# Altium schematic sheet ESP32_Dongle.SchDoc
size 599 x 400 mm; SheetNumber: 1; SheetTotal: 1
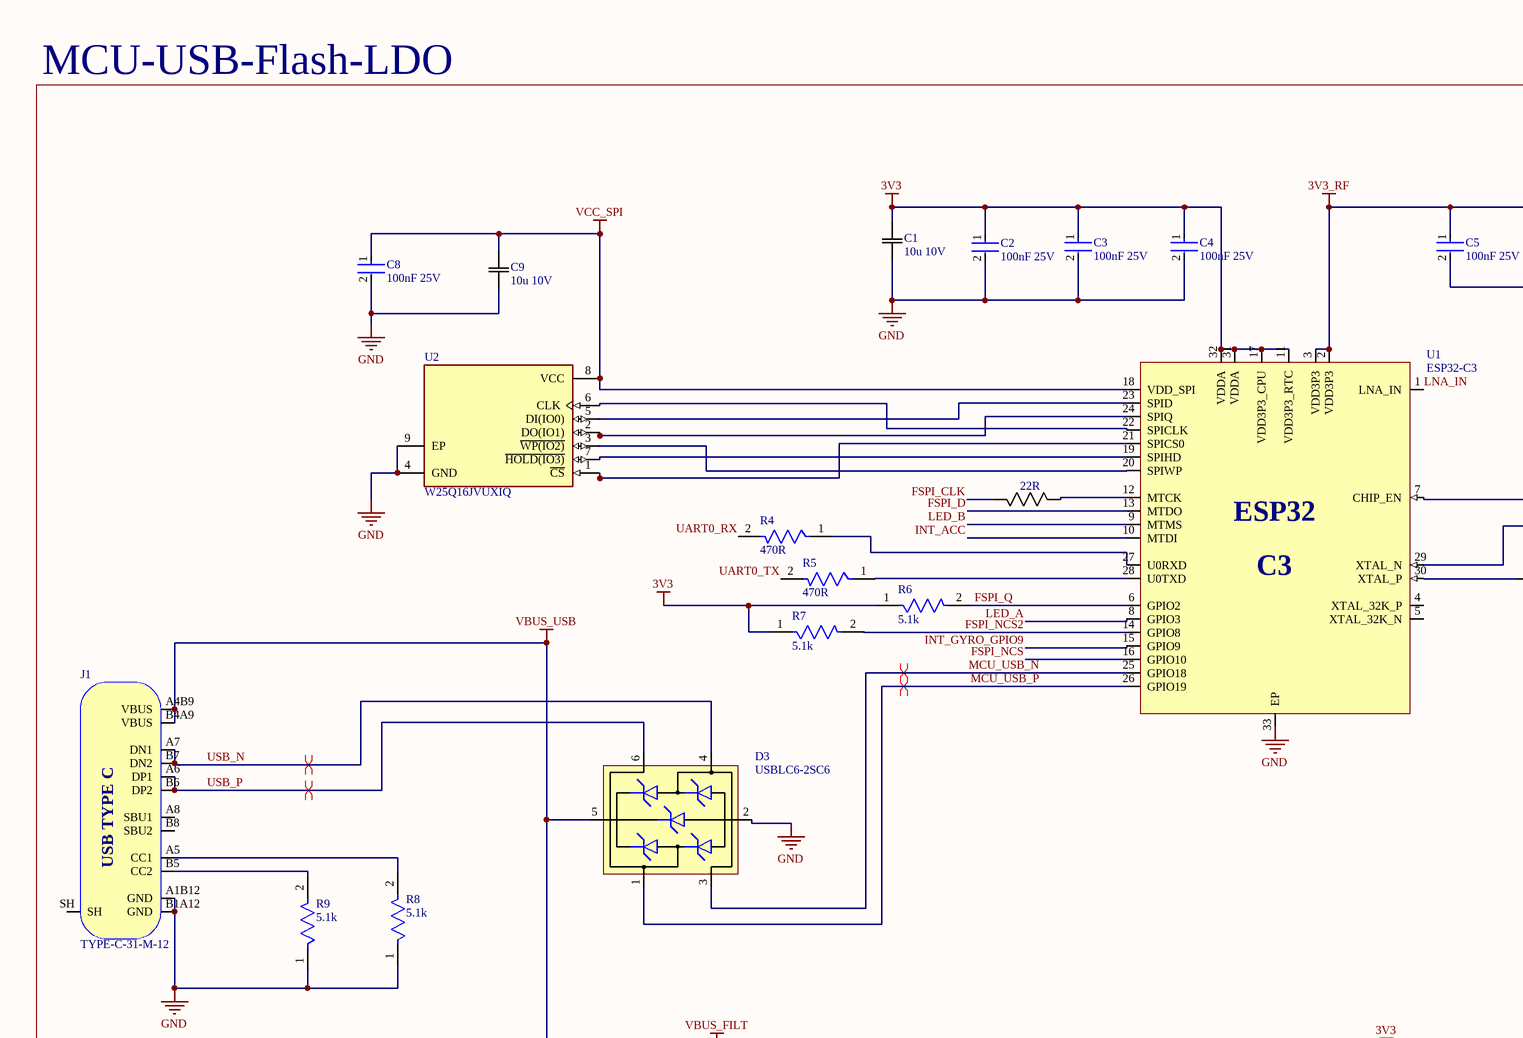
[diagram p0: ESP32_Dongle.SchDoc, top left]
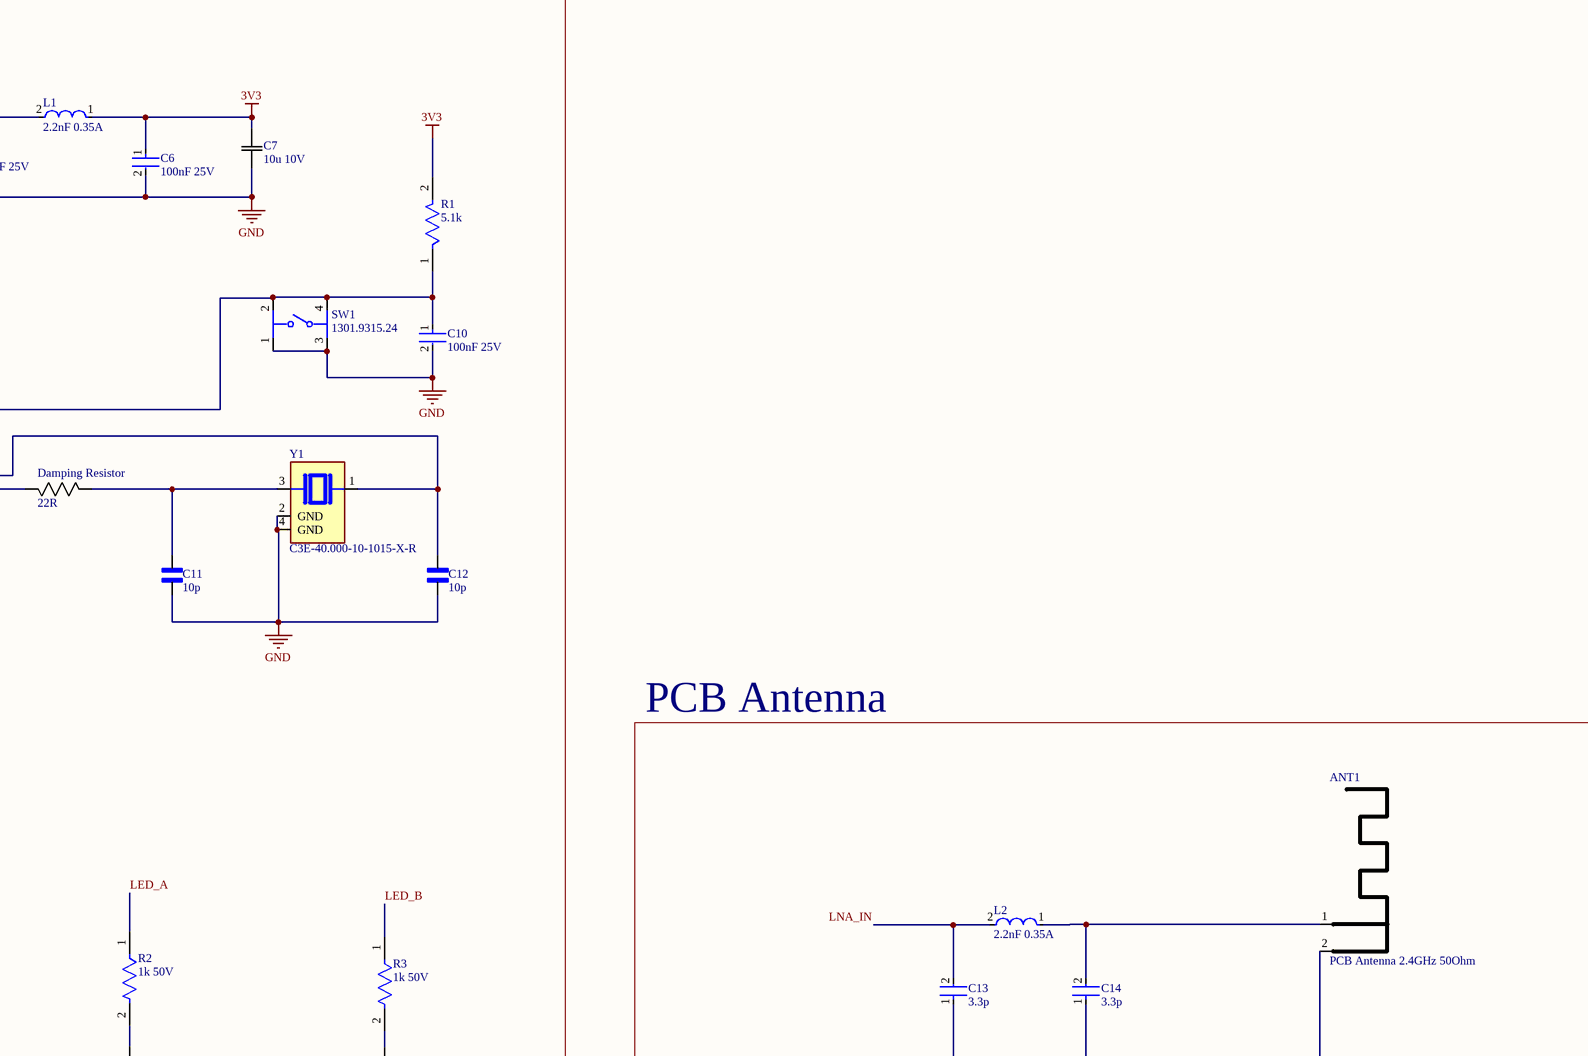
[diagram p1: ESP32_Dongle.SchDoc, top right]
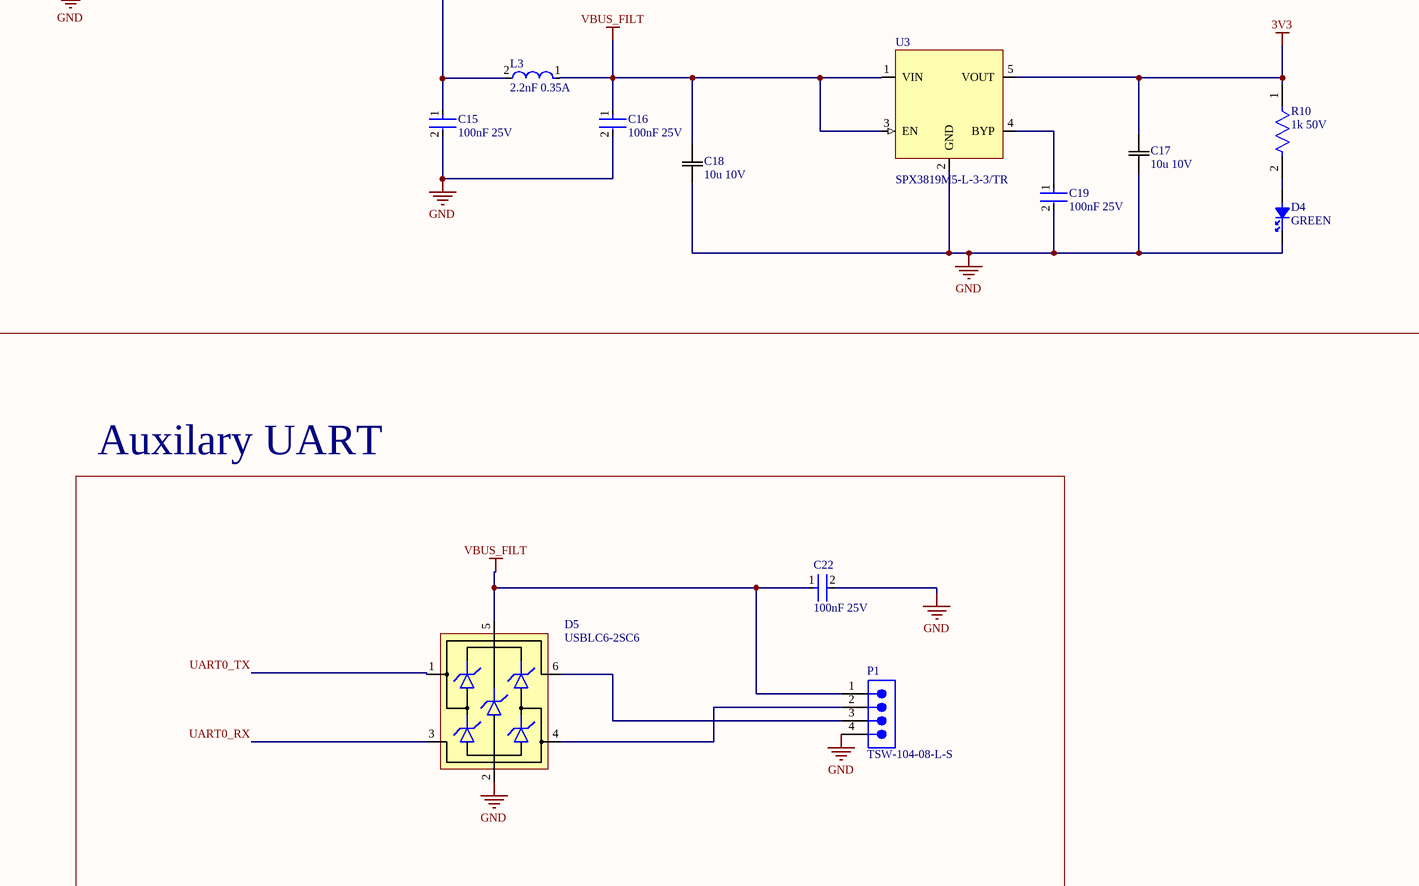
[diagram p2: ESP32_Dongle.SchDoc, bottom left]
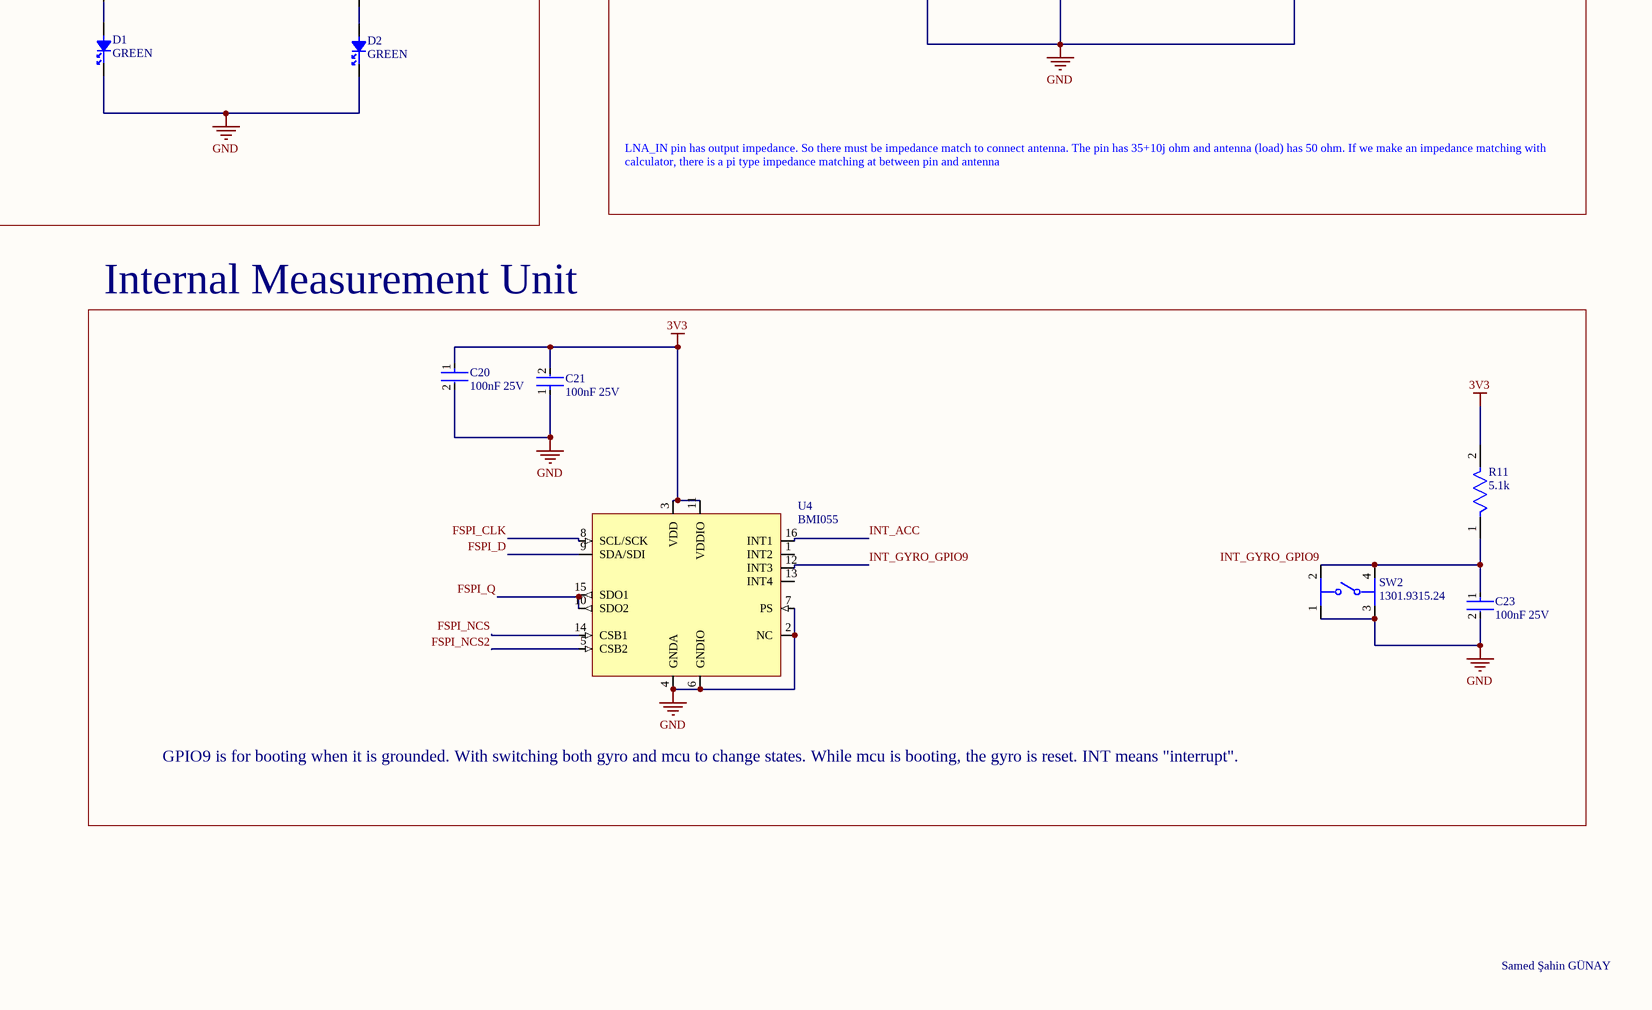
[diagram p3: ESP32_Dongle.SchDoc, bottom right]

## Parts
?  22R  [0402_PAN]
ANT1  PCB Antenna 2.4GHz 50Ohm  [ANT_IFA_USB_2_4GHZ_50R]  (no BOM)
C1  10u 10V  [CAP_0603J_AVX]
C2  100nF 25V  [FP-C0402-BB-MFG]
C3  100nF 25V  [FP-C0402-BB-MFG]
C4  100nF 25V  [FP-C0402-BB-MFG]
C5  100nF 25V  [FP-C0402-BB-MFG]
C6  100nF 25V  [FP-C0402-BB-MFG]
C7  10u 10V  [CAP_0603J_AVX]
C8  100nF 25V  [FP-C0402-BB-MFG]
C9  10u 10V  [CAP_0603J_AVX]
C10  100nF 25V  [FP-C0402-BB-MFG]
C11  10p  [CAPC1005X55N]
C12  10p  [CAPC1005X55N]
C13  3.3p  [FP-C0402-BB-MFG]
C14  3.3p  [FP-C0402-BB-MFG]
C15  100nF 25V  [FP-C0402-BB-MFG]
C16  100nF 25V  [FP-C0402-BB-MFG]
C17  10u 10V  [CAP_0603J_AVX]
C18  10u 10V  [CAP_0603J_AVX]
C19  100nF 25V  [FP-C0402-BB-MFG]
C20  100nF 25V  [FP-C0402-BB-MFG]
C21  100nF 25V  [FP-C0402-BB-MFG]
C22  100nF 25V  [FP-C0402-BB-MFG]
C23  100nF 25V  [FP-C0402-BB-MFG]
D1  GREEN  [LED0402G]
D2  GREEN  [LED0402G]
D3  USBLC6-2SC6  [SOT-23-6]
D4  GREEN  [LED0402G]
D5  USBLC6-2SC6  [SOT-23-6]
Damping_Resistor  22R  [0402_PAN]
J1  TYPE-C-31-M-12  [TYPE-C-31-M-12]
L1  2.2nF 0.35A  [FP-MLZ1005-IPC_B]
L2  2.2nF 0.35A  [FP-MLZ1005-IPC_B]
L3  2.2nF 0.35A  [FP-MLZ1005-IPC_B]
P1  TSW-104-08-L-S  [SMTC-TSW-104-08-X-S]
R1  5.1k  [FP-RN73R1E-IPC_C]
R2  1k 50V  [FP-AC0402-IPC_C]
R3  1k 50V  [FP-AC0402-IPC_C]
R4  470R  [FP-AC0402-MFG]
R5  470R  [FP-AC0402-MFG]
R6  5.1k  [FP-RN73R1E-IPC_C]
R7  5.1k  [FP-RN73R1E-IPC_C]
R8  5.1k  [FP-RN73R1E-IPC_C]
R9  5.1k  [FP-RN73R1E-IPC_C]
R10  1k 50V  [FP-AC0402-IPC_C]
R11  5.1k  [FP-RN73R1E-IPC_C]
SW1  1301.9315.24  [FP-1301_9315_24-MFG]
SW2  1301.9315.24  [FP-1301_9315_24-MFG]
U1  ESP32-C3  [QFN32-5x5]
U2  W25Q16JVUXIQ  [FP-UX-MFG]
U3  SPX3819M5-L-3-3/TR  [SOT-23-5]
U4  BMI055  [BMI088]
Y1  C3E-40.000-10-1015-X-R  [XTAL_C3E-40.000-10-1015-X-R]

## Blocks framed on the sheet
MCU-USB-Flash-LDO: ? C1-C12 C15-C19 D1-D4 Damping_Resistor J1 L1 L3 R1-R10 SW1 U1-U3 Y1
PCB Antenna: ANT1 C13 C14 L2
Internal Measurement Unit: C20 C21 C23 R11 SW2 U4
Auxilary UART: C22 D5 P1

## Nets
3V3: C1.2 C2.1 C3.1 C4.1 C6.1 C7.2 C17.2 C20.1 C21.2 L1.1 R1.2 R6.1 R7.1 R10.1 R11.2 U1.11(VDD3P3_RTC) U1.17(VDD3P3_CPU) U1.31(VDDA) U1.32(VDDA) U3.5(VOUT) U4.3(VDD) U4.11(VDDIO)
3V3_RF: C5.1 L1.2 U1.2(VDD3P3) U1.3(VDD3P3)
GND: ANT1.2(GND) C1.1 C2.2 C3.2 C4.2 C5.2 C6.2 C7.1 C8.2 C9.1 C10.2 C11.1 C12.1 C13.1 C14.1 C15.2 C16.2 C17.1 C18.1 C19.2 C20.2 C21.1 C22.2 C23.2 D1.1 D2.1 D3.2(GND) D4.1 D5.2(GND) J1.A1B12(GND) J1.B1A12(GND) P1.4 R8.1 R9.1 SW1.1 SW1.3 SW2.1 SW2.3 U1.33(EP) U2.4(GND) U2.9(EP) U3.2(GND) U4.2(NC) U4.4(GNDA) U4.6(GNDIO) U4.7(PS) Y1.2(GND) Y1.4(GND)
VBUS_FILT: C16.1 C18.2 C22.1 D5.5(VBUS) L3.1 P1.1 U3.1(VIN) U3.3(EN)
VBUS_USB: C15.1 D3.5(VBUS) J1.A4B9(VBUS) J1.B4A9(VBUS) L3.2
VCC_SPI: C8.1 C9.2 U1.18(VDD_SPI) U2.8(VCC)
FSPI_CLK: ?.2 U4.8(SCL/SCK)
FSPI_D: U1.13(MTDO) U4.9(SDA/SDI)
FSPI_NCS: U1.16(GPIO10) U4.14(CSB1)
FSPI_NCS2: R7.2 U1.14(GPIO8) U4.5(CSB2)
FSPI_Q: R6.2 U1.6(GPIO2) U4.10(SDO2) U4.15(SDO1)
INT_ACC: U1.10(MTDI) U4.16(INT1)
INT_GYRO_GPIO9: C23.1 R11.1 SW2.2 SW2.4 U1.15(GPIO9) U4.12(INT3)
LED_A: R2.1 U1.8(GPIO3)
LED_B: R3.1 U1.9(MTMS)
LNA_IN: C13.2 L2.2 U1.1(LNA_IN)
MCU_USB_N: D3.3(IO2) U1.25(GPIO18)
MCU_USB_P: D3.1(IO1) U1.26(GPIO19)
UART0_RX: D5.3(IO2) R4.2
UART0_TX: D5.1(IO1) R5.2
USB_N: D3.4(IO2) J1.A7(DN1) J1.B7(DN2)
USB_P: D3.6(IO1) J1.A6(DP1) J1.B6(DP2)
Net?_1: ?.1 U1.12(MTCK)
NetANT1_1: ANT1.1(RF) C14.2 L2.1
NetC10_1: C10.1 R1.1 SW1.2 SW1.4 U1.7(CHIP_EN)
NetC11_2: C11.2 Damping_Resistor.1 Y1.3
NetC12_2: C12.2 U1.29(XTAL_N) Y1.1
NetC19_1: C19.1 U3.4(BYP)
NetD1_2: D1.2 R2.2
NetD2_2: D2.2 R3.2
NetD4_2: D4.2 R10.2
NetD5_4: D5.4(IO2) P1.2
NetD5_6: D5.6(IO1) P1.3
NetDamping_Resistor_2: Damping_Resistor.2 U1.30(XTAL_P)
NetJ1_A5: J1.A5(CC1) R8.2
NetJ1_B5: J1.B5(CC2) R9.2
NetR4_1: R4.1 U1.27(U0RXD)
NetR5_1: R5.1 U1.28(U0TXD)
NetU1_19: U1.19(SPIHD) U2.7(~{HOLD(IO3)})
NetU1_20: U1.20(SPIWP) U2.3(~{WP(IO2)})
NetU1_21: U1.21(SPICS0) U2.1(~{CS})
NetU1_22: U1.22(SPICLK) U2.6(CLK)
NetU1_23: U1.23(SPID) U2.5(DI(IO0))
NetU1_24: U1.24(SPIQ) U2.2(DO(IO1))

Not connected (* = marked no-connect by the designer): J1 A8(SBU1) B8(SBU2) SH; U1 4(XTAL_32K_P) 5(XTAL_32K_N); U4 1(INT2) 13(INT4)

## Layout directives
differential pair: MCU_USB_N, MCU_USB_P, USB_N, USB_P

## Notes on the sheet
- LNA_IN pin has output impedance. So there must be impedance match to connect antenna. The pin has 35+10j ohm and antenna (load) has 50 ohm. If we make an impedance matching with calculator, there is a pi type impedance matching at between pin and antenna
- GPIO9 is for booting when it is grounded. With switching both gyro and mcu to change states. While mcu is booting, the gyro is reset. INT means "interrupt".
- Samed Şahin GÜNAY
- (in symbol ESP32-C3) ESP32; C3
- (in symbol TYPE-C-31-M-12) USB TYPE C

## Library data of the parts
? Damping_Resistor = ERJ2RKD22R0X: No Description Available; Manufacturer_Name: Panasonic; Copyright: Copyright (C) 2026 Ultra Librarian. All rights reserved.; Manufacturer_Part_Number: ERJ2RKD22R0X
ANT1 = ANT_IFA_USB_2_4GHZ_50R: Inverted F 2.4GHz ISM PCB Antenna 50 Ohm; ComponentLink1Description: Datasheet; ComponentLink1URL: https://www.ti.com/lit/an/swra117d/swra117d.pdf
C1 C7 C9 C17 C18 = 0603ZD106KAT4A: No Description Available; Manufacturer_Name: KYOCERA AVX; Copyright: Copyright (C) 2026 Ultra Librarian. All rights reserved.; Manufacturer_Part_Number: 0603ZD106KAT4A
C2-C6 C8 C10 C15 C16 C19-C23 = CMP-03020-014070-2: CAP CER 0.1UF 25V X5R 0402; Manufacturer: Kemet; Manufacturer Part Number: C0402C104M3PAC7867; Material: Ceramic; Tolerance: 0.2; Value: 0.10 μF; Temperature Coefficient: 15%; Height: 0.55mm; Category: Cap; Temperature: -55°C to +125°C; Automotive: No; Package: C0402-BB; Temperature Range Low: -55°C; ComponentLink2Description: Datasheet; Device Class L3: Ceramic Capacitors; ComponentLink2URL: https://content.kemet.com/datasheets/KEM_C1002_X7R_SMD.pdf; Octopart: https://octopart.com/c0402c104m3pac7867-kemet-84304880; Temperature Characteristic: X5R; RoHS: TRUE; Temperature Range High: +125°C; Device Class L1: Passive Components; Capacitance: 0.10 μF; Lead Free: Yes; Voltage Rating: 25 V; Ipc Land Pattern Name: CAPC10050X50; Device Class L2: Capacitors; Digikey Description: CAP CER 0.1UF 25V X5R 0402
C11 C12 = C0402C100K5GACTU: 10 pF Â±10% 50V Ceramic Capacitor C0G, NP0 0402 (1005 Metric); MF: KEMET; SnapEDA_Link: https://www.snapeda.com/parts/C0402C100K5GACTU/KEMET/view-part/?ref=snap; Package: 0402 KEMET; Value: *; MP: C0402C100K5GACTU; Check_prices: https://www.snapeda.com/parts/C0402C100K5GACTU/KEMET/view-part/?ref=eda
C13 C14 = CMP-03020-024301-1: CAP CER 0.033UF 25V X7R 0402; Manufacturer: Kemet; Manufacturer Part Number: C0402C333K3RACAUTO; Material: Ceramic; Temperature Coefficient: 15%; Tolerance: 0.1; Capacitance: 33,000 pF; Value: 33,000 pF; Device Class L3: Ceramic Capacitors; Height: 0.55mm; Temperature Characteristic: X7R; Device Class L1: Passive Components; Automotive: No; ComponentLink2Description: Datasheet; Temperature Range Low: -55°C; Category: Cap; RoHS: TRUE; Package: C0402-BB; ComponentLink2URL: https://content.kemet.com/datasheets/KEM_C1002_X7R_SMD.pdf; Device Class L2: Capacitors; Ipc Land Pattern Name: CAPC10050X50; Digikey Description: CAP CER 0.033UF 25V X7R 0402; Lead Free: Yes; Octopart: https://octopart.com/c0402c333k3racauto-kemet-47202579; Temperature Range High: +125°C; Temperature: -55°C to +125°C; Voltage Rating: 25 V
D1 D2 D4 = VLMG1500-GS08: LED YLW-GRN 0402 SMD; Manufacturer: Vishay; Color: Green,Yellow; Lens Color: Clear; Viewing Angle: 130°; Forward Current: 30mA; Forward Voltage: 2V; Luminous Intensity: 35mcd; Dominant Wavelength: 571nm; Test Current: 20mA; Number of Elements: 1; Power Dissipation: 75mW; Lens Style: Rectangular; Reverse Voltage: 5V; Supplier: Digikey; Supplier Part Number: VLMG1500-GS08CT-ND; Manufacturer Part Number: VLMG1500-GS08; RoHS: Yes; Category: LEDs; Stock: 98; Pricing: 1=0.34, 10=0.265, 100=0.119, 500=0.10746, 1000=0.08827 (USD); Mounting Technology: Surface Mount; Case/Package: 0402; Pins: 2; Case Code (Metric): 1005; Case Code (Imperial): 0402; Min Operating Temperature: -30°C; Max Operating Temperature: 85°C; Package Quantity: 1; Packaging: Tape and Reel; Illumination Color: Green; Wavelength: 571nm; Number of LEDs: 1; Power Rating: 75mW; Series: CHipLED; Length: 1mm; Width: 0.5mm; Height: 0.35mm; Depth: 0.5mm; Radiation Hardening: No; Lead Free: Lead Free; RoHS Compliant: Yes; Reach SVHC Compliant: Unknown; ComponentLink1URL: https://datasheet.ciiva.com/12071/vlmo1500-244705-12071911.pdf?src-supplier=Mouser; ComponentLink1Description: https://datasheet.ciiva.com/12071/vlmo1500-244705-12071911.pdf?src-supplier=Mouser; ComponentLink2URL: https://datasheet.ciiva.com/30005/vlmo1500-30005134.pdf?src-supplier=Avnet; ComponentLink2Description: https://datasheet.ciiva.com/30005/vlmo1500-30005134.pdf?src-supplier=Avnet; LCSC Part Number: C511404
D3 D5 = USBLC6-2SC6: Low-Capacitance ESD Protection USB; Manufacturer: STMicroelectronics; Manufacturer Part Number: USBLC6-2SC6; Distributor Link: https://www.mouser.de/ProductDetail/STMicroelectronics/USBLC6-2SC6?qs=po45yt2pPpu%2FhNIlwQdTlg%3D%3D
J1 = TYPE-C-31-M-12: USB Type C Connector Horizontal SMT; Manufacturer: Koren Hroparts; Manufacturer Part Number: TYPE-C-31-M-12
L1-L3 = CMP-08253-000201-1: Shielded Multilayer Inductor 2.2uH ±20% 350mA 715mΩ SMD 0402; Core Material: Ferrite; Saturation Current: 60mA; DC Resistance (DCR): 715mR; Self Resonant Frequency: 120MHz; Test Frequency: 2MHz; RoHS Compliant: Yes; Tolerance: 20%; Current Rating: 350mA; Min Operating Temperature: -55°C; Case Code (Imperial): 0402; Length: 0.039inch; Case/Package: 0402; Inductance: 2.2uH; Mount: Surface Mount; Package Quantity: 10000; Shielding: Shielded; Width: 0.02inch; Case Code (Metric): 1005; Height - Seated (Max): 0.022inch; Max Operating Temperature: 125°C; Packaging: Tape and Reel
P1 = CMP-1024-00358-1: 0.025" SQ Post Header, Through-hole, Vertical, -55 to 125 degC, 2.54 mm Pitch, 4-Pin, Male, RoHS; Manufacturer: Samtec; Pitch: 2.54 mm; PartNumber: TSW-104-08-L-S; RoHS: True; Temperature Range: -55 to 125 degC; PackageDescription: .025[0.64] SQ. Post Terminal Strip Assembly; Orientation: Vertical; ComponentLink2URL: http://www.samtec.com/documents/webfiles/pdf/TSW_TH.PDF; ComponentLink1Description: Manufacturer URL; ComponentLink2Description: Datasheet; PackageVersion: DM, 8/1988; ComponentLink3URL: http://www.samtec.com/documents/webfiles/cpdf/TSW-XXX-XX-XXX-X-XX-XXX-MKT.pdf; Mounting Technology: Through-hole; PackageReference: TSW-104-08-X-S; ComponentLink3Description: Package Specification; ComponentLink1URL: http://www.samtec.com; DatasheetVersion: F-214
R1 R6-R9 R11 = CMP-04015-008529-1: 5.1kΩ ±1% 0.063W, 1/16W Chip Resistor 0402 (1005 Metric) Moisture Resistant Thin Film
R2 R3 R10 = CMP-03412-047873-1: RES 1kΩ ±1% 0.063W 0402; RoHS Compliant: Yes
R4 R5 = CMP-03412-049712-1: RES 470Ω ±5% 0.063W 0402
SW1 SW2 = CMP-26321-000002-1: SWITCH TACTILE SPST-NO 0.05A 12V; Illumination Type: Illuminated; Mechanical Life: 100000Cycles; Actuator Type: Standard; Throw Configuration: SPST; Current Rating: 50mA; Switch Function: Off-Mom; Operating Force: 1.6N; Ratings: IP40; Switch Travel: 0.25mm; Max Voltage Rating (DC): 12V; Length: 6mm; REACH SVHC: No SVHC; Contact Plating: Silver; Package Quantity: 1000; Radiation Hardening: No; Packaging: Tape and Reel; RoHS Compliant: Yes; Orientation: Straight; Mount: Surface Mount; Depth: 10mm; Voltage Rating (AC): 12V; Termination: Gull Wing; Max Operating Temperature: 70°C; Case/Package: SMD/SMT; Voltage Rating (DC): 12V; Min Operating Temperature: -20°C; Series: LSH; Max Current Rating: 50mA
U1 = ESP32-C3: Ultra­Low­Power SoC with RISC­V Single­Core CPU Supporting IEEE 802.11b/g/n (2.4 GHz Wi­Fi) and Bluetooth® 5 (LE); Manufacturer: Espressif; Manufacturer Part Number: ESP32-C3; LCSC: C2838500
U2 = CMP-78876-000011-1: IC FLASH 16MBIT SPI/QUAD 8USON; RoHS Compliant: Yes
U3 = SPX3819M5-L-3-3/TR: 500mA +3.3V Low-Noise LDO Voltage Regulator; Manufacturer: MaxLinear; Manufacturer Part Number: SPX3819M5-L-3-3/TR
U4 = BMI055: Inertial Measurement Unit IMU 6-Axis LGA; Manufacturer: Bosch; Manufacturer Part Number: BMI055; LCSC: C189620
Y1 = C3E-40.000-10-1015-X-R: 40 MHz Â±10ppm Crystal 10pF 50 Ohms 4-SMD, No Lead; MF: Aker Technology USA; SnapEDA_Link: https://www.snapeda.com/parts/C3E-40.000-10-1015-X-R/Aker/view-part/?ref=snap; Package: SMD-4 Aker; Value: *; MP: C3E-40.000-10-1015-X-R; Check_prices: https://www.snapeda.com/parts/C3E-40.000-10-1015-X-R/Aker/view-part/?ref=eda